# EAGLE design untitled (EAGLE 9.5.0)
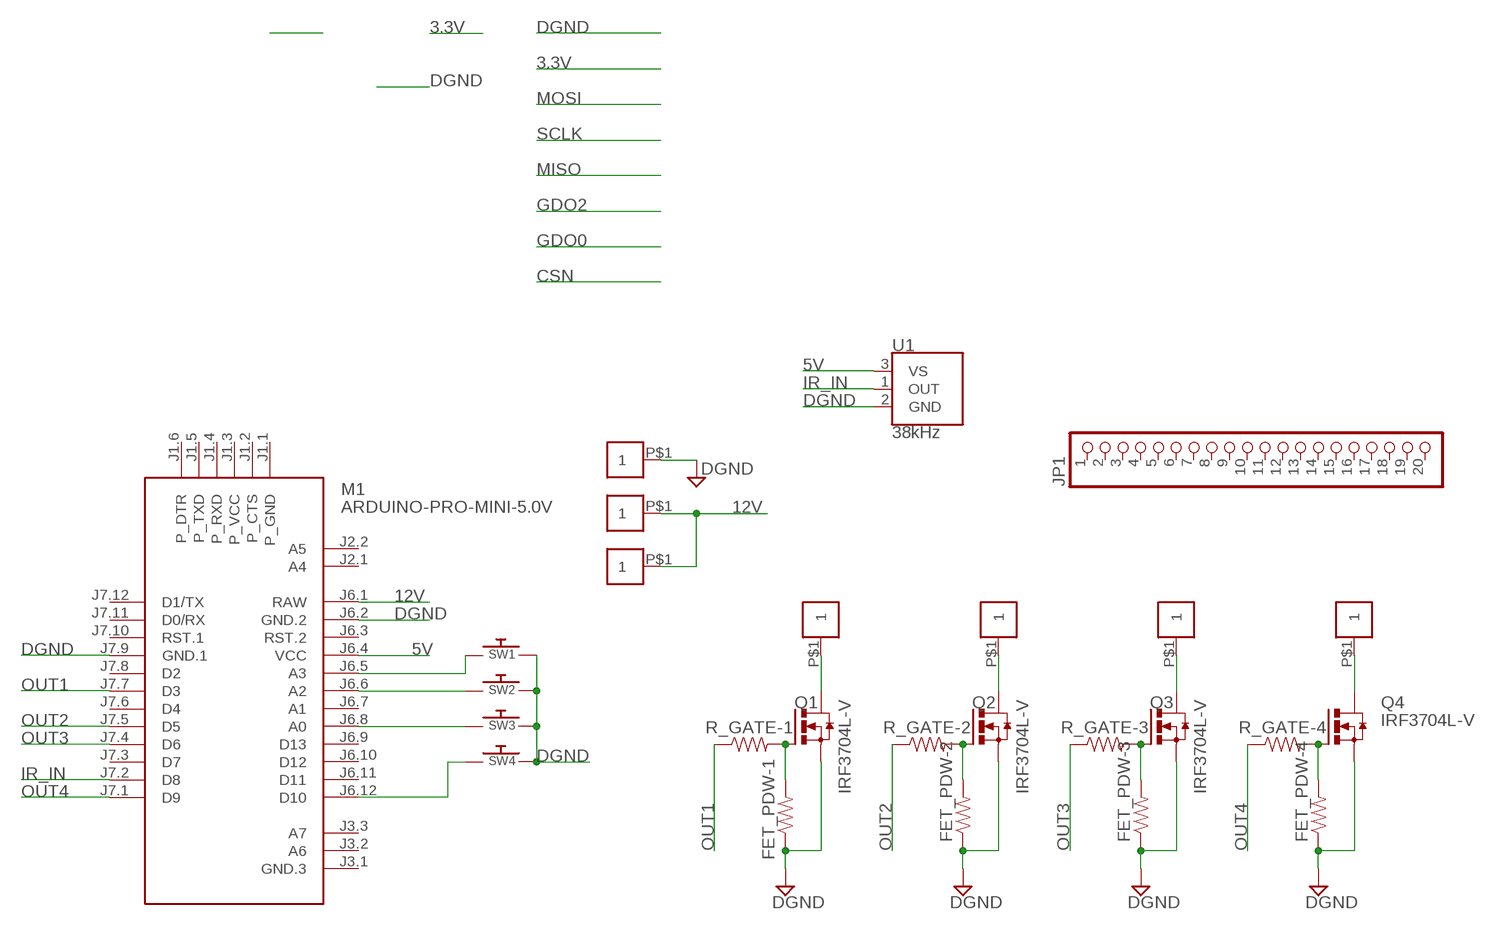
[diagram p0: schematic, sheet 1]

## Parts
FET_PDW-1  RESISTOR0603-RES  [0603-RES]
FET_PDW-2  RESISTOR0603-RES  [0603-RES]
FET_PDW-3  RESISTOR0603-RES  [0603-RES]
FET_PDW-4  RESISTOR0603-RES  [0603-RES]
JP1  PINHD-1X20  [1X20]
M1  ARDUINO-PRO-MINI-5.0V  [ARDUINO-PRO-MINI]
Q1  IRF3704L-V  [TO262-V]
Q2  IRF3704L-V  [TO262-V]
Q3  IRF3704L-V  [TO262-V]
Q4  IRF3704L-V  [TO262-V]
R_GATE-1  RESISTOR0603-RES  [0603-RES]
R_GATE-2  RESISTOR0603-RES  [0603-RES]
R_GATE-3  RESISTOR0603-RES  [0603-RES]
R_GATE-4  RESISTOR0603-RES  [0603-RES]
SW1  SWITCH_PUSHBUTTONC&K_KSS  [BTN_CK_KSS]
SW2  SWITCH_PUSHBUTTONC&K_KSS  [BTN_CK_KSS]
SW3  SWITCH_PUSHBUTTONC&K_KSS  [BTN_CK_KSS]
SW4  SWITCH_PUSHBUTTONC&K_KSS  [BTN_CK_KSS]
U1  38kHz  TSOP38238  [TSOP382]
U$2  1X01_2.54MM  [1X01_2.54MM]
U$3  1X01_2.54MM  [1X01_2.54MM]
U$4  1X01_2.54MM  [1X01_2.54MM]
U$5  1X01_2.54MM  [1X01_2.54MM]
U$6  1X01_2.54MM  [1X01_2.54MM]
U$7  1X01_2.54MM  [1X01_2.54MM]
U$8  1X01_2.54MM  [1X01_2.54MM]

## Nets
5V: M1.J6.4(VCC) U1.3(VS)
12V: M1.J6.1(RAW) U$5.P$1 U$8.P$1
DGND: FET_PDW-1.1 FET_PDW-2.1 FET_PDW-3.1 FET_PDW-4.1 M1.J6.2(GND.2) M1.J7.9(GND.1) Q1.3(S) Q2.3(S) Q3.3(S) Q4.3(S) SW1.P$2 SW2.P$2 SW3.P$2 SW4.P$2 U1.2(GND) U$7.P$1
IR_IN: M1.J7.2(D8) U1.1(OUT)
N$1: FET_PDW-1.2 Q1.1(G) R_GATE-1.2
N$2: FET_PDW-2.2 Q2.1(G) R_GATE-2.2
N$3: FET_PDW-3.2 Q3.1(G) R_GATE-3.2
N$5: Q1.2(D) U$2.P$1
N$6: Q2.2(D) U$3.P$1
N$7: Q3.2(D) U$4.P$1
N$8: FET_PDW-4.2 Q4.1(G) R_GATE-4.2
N$9: Q4.2(D) U$6.P$1
N$10: M1.J6.5(A3) SW1.P$1
N$11: M1.J6.6(A2) SW2.P$1
N$12: M1.J6.8(A0) SW3.P$1
N$13: M1.J6.12(D10) SW4.P$1
OUT1: M1.J7.7(D3) R_GATE-1.1
OUT2: M1.J7.5(D5) R_GATE-2.1
OUT3: M1.J7.4(D6) R_GATE-3.1
OUT4: M1.J7.1(D9) R_GATE-4.1
Unconnected: JP1.1 JP1.2 JP1.3 JP1.4 JP1.5 JP1.6 JP1.7 JP1.8 JP1.9 JP1.10 JP1.11 JP1.12 JP1.13 JP1.14 JP1.15 JP1.16 JP1.17 JP1.18 JP1.19 JP1.20 M1.J1.1(P_GND) M1.J1.2(P_CTS) M1.J1.3(P_VCC) M1.J1.4(P_RXD) M1.J1.5(P_TXD) M1.J1.6(P_DTR) M1.J2.1(A4) M1.J2.2(A5) M1.J3.1(GND.3) M1.J3.2(A6) M1.J3.3(A7) M1.J6.3(RST.2) M1.J6.7(A1) M1.J6.9(D13) M1.J6.10(D12) M1.J6.11(D11) M1.J7.3(D7) M1.J7.6(D4) M1.J7.8(D2) M1.J7.10(RST.1) M1.J7.11(D0/RX) M1.J7.12(D1/TX)

## Library data of the parts
FET_PDW-1-FET_PDW-4 R_GATE-1-R_GATE-4 = 0000_nexxto_resistors:RESISTOR: Resistor Basic schematic elements and footprints for 0603, 1206, and PTH 1/10th watt (small) resistors.
JP1 = adafruit:PINHD-1X20: PIN HEADER
M1 = diy modules:ARDUINO-PRO-MINI-*: Arduino Pro Mini and compatible devices More details available here: https://www.arduino.cc/en/Main/ArduinoBoardProMini Click here to find device on ebay.com <http://www.ebay.com/sch/arduino+pro+mini>
Q1-Q4 = transistor-power:IRF3704: SMPS MOSFET HEXFET® Power MOSFET Source: http://www.irf.com/product-info/datasheets/data/irf3704.pdf
SW1-SW4 = adafruit:SWITCH_PUSHBUTTON: Buttons SOFTTOUCHSMD_SJ - Soft touch temporary push button (Super Junk Akihabara) Compatible with SKPMANE010 [Mouser: 688-SKPMAN] C&K_KSS = Digikey: KSS221GLFS
U1 = sparkFun-Sensors:TSOP382: Vishay Semiconductor TSOP32838 - 38kHz IR Receiver These products are miniaturized IR receiver modules for infrared remote control systems. A PIN diode and a preamplifier are assembled on a leadframe, the epoxy package contains an IR filter. The demodulated output signal can be directly connected to a microprocessor for decoding.; PROD_ID: SEN-10266
U$2-U$8 = 0000_nexxto_connectors:1X01_2.54MM

## Board
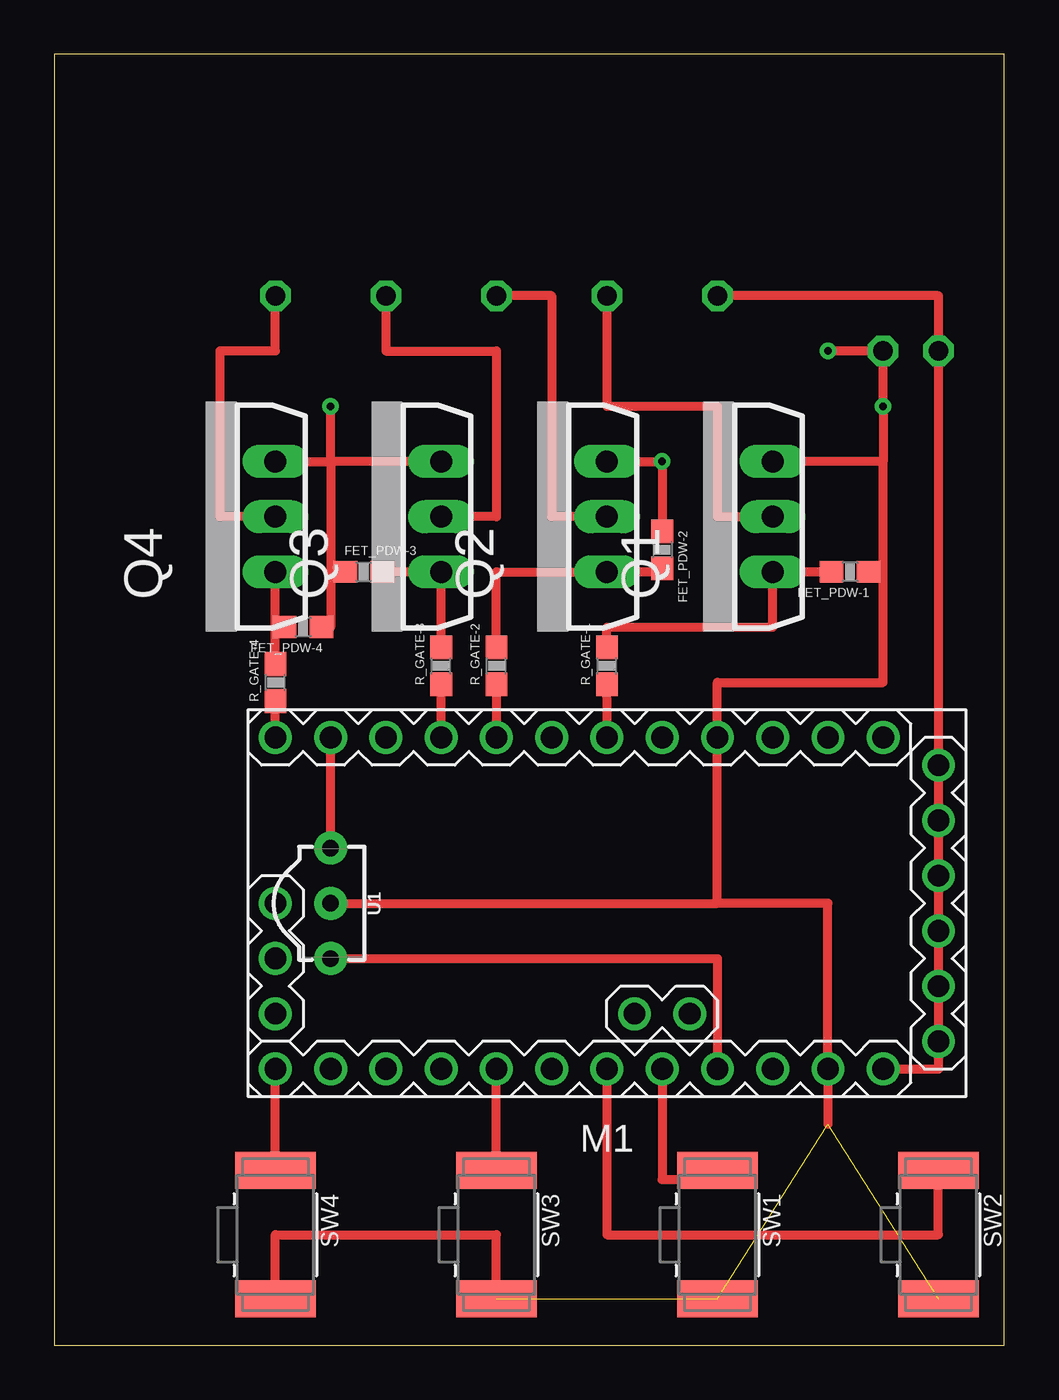
[diagram p1: board, top side]
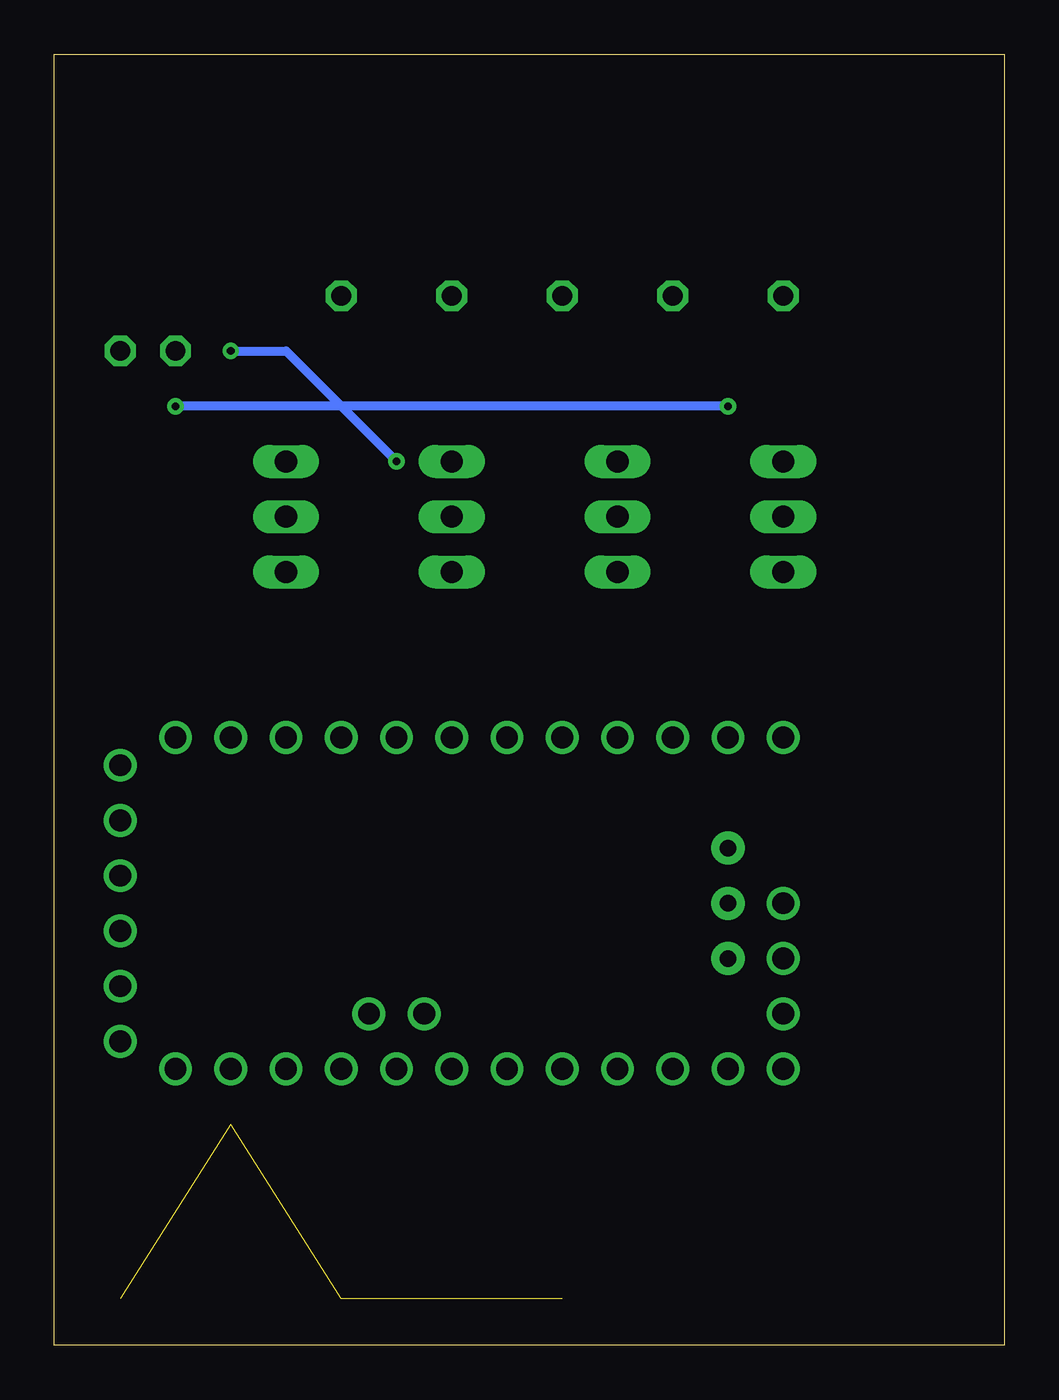
[diagram p2: board, bottom side, seen from below]

Size 43.67 x 59.36 mm. Coordinates in mm from the lower left corner, seen from the top.
Outline: 0,0 43.67,0 43.67,59.36 0,59.36 0,0
Copper layers (1*16): Top 0.035mm / dielectric 1.5mm / Bottom 0.035mm
Design rules "default": minimum track width 6mil, minimum drill 0.35mm, track to track 6mil, track to pad 6mil, pad to pad 6mil, via to via 6mil, smd to smd 6mil, copper to edge 40mil, drill to drill 6mil, minimum pad ring 10mil, minimum via ring 8mil, stop-mask expansion 4mil, vias tented up to drill 0mil, thermal gap 10mil

### Footprints (pad centres in the part's own frame; a part is rotated, then mirrored left to right if it is on the bottom)
0603-RES = smd 1.1 x 1: 1 -0.85,0; 2 0.85,0
1X20 = drill 1.016 long: 1 -24.13,0; 2 -21.59,0; 3 -19.05,0; 4 -16.51,0; 5 -13.97,0; 6 -11.43,0; 7 -8.89,0; 8 -6.35,0; 9 -3.81,0; 10 -1.27,0; 11 1.27,0; 12 3.81,0; 13 6.35,0; 14 8.89,0; 15 11.43,0; 16 13.97,0; 17 16.51,0; 18 19.05,0; 19 21.59,0; 20 24.13,0
ARDUINO-PRO-MINI = drill 1: J1.1 -15.24,6.35; J1.2 -15.24,3.81; J1.3 -15.24,1.27; J1.4 -15.24,-1.27; J1.5 -15.24,-3.81; J1.6 -15.24,-6.35; J2.1 -1.27,5.08; J2.2 -3.81,5.08; J3.1 15.24,0; J3.2 15.24,2.54; J3.3 15.24,5.08; J6.1 -12.7,7.62; J6.2 -10.16,7.62; J6.3 -7.62,7.62; J6.4 -5.08,7.62; J6.5 -2.54,7.62; J6.6 0,7.62; J6.7 2.54,7.62; J6.8 5.08,7.62; J6.9 7.62,7.62; J6.10 10.16,7.62; J6.11 12.7,7.62; J6.12 15.24,7.62; J7.1 15.24,-7.62; J7.2 12.7,-7.62; J7.3 10.16,-7.62; J7.4 7.62,-7.62; J7.5 5.08,-7.62; J7.6 2.54,-7.62; J7.7 0,-7.62; J7.8 -2.54,-7.62; J7.9 -5.08,-7.62; J7.10 -7.62,-7.62; J7.11 -10.16,-7.62; J7.12 -12.7,-7.62
TO262-V = drill 1.016 long: 1 -2.54,0; 2 0,0; 3 2.54,0
BTN_CK_KSS = smd 1.7 x 3.7: P$1 -2.95,0; P$2 2.95,0
TSOP382 = drill 0.762 pad 1.524: 1 -2.54,0; 2 0,0; 3 2.54,0
1X01_2.54MM = drill 0.9 octagon: P$1 0,0

### Placement (x,y rotation side)
FET_PDW-1  36.58,35.56 180 top
FET_PDW-2  27.94,36.58 270 top
FET_PDW-3  14.22,35.56 0 top
FET_PDW-4  11.43,33.02 180 top
JP1  50.8,29.21 90 top  (outside the outline)
M1  25.4,20.32 180 top
Q1  33.02,38.1 90 top
Q2  25.4,38.1 90 top
Q3  17.78,38.1 90 top
Q4  10.16,38.1 90 top
R_GATE-1  25.4,31.24 90 top
R_GATE-2  20.32,31.24 90 top
R_GATE-3  17.78,31.24 90 top
R_GATE-4  10.16,30.48 90 top
SW1  30.48,5.08 270 top
SW2  40.64,5.08 270 top
SW3  20.32,5.08 270 top
SW4  10.16,5.08 270 top
U1  12.7,20.32 270 top
U$2  25.4,48.26 0 top
U$3  20.32,48.26 0 top
U$4  15.24,48.26 0 top
U$5  30.48,48.26 0 top
U$6  10.16,48.26 0 top
U$7  38.1,45.72 0 top
U$8  40.64,45.72 0 top

### Tracks (layer width: path | path; a pad name or v marks a point on that pad's centre or on a via)
5V
  Top 0.406: U1.3 30.48,17.78 M1.J6.4
12V
  Top 0.406: U$5.P$1 40.64,48.26 U$8.P$1 40.64,12.7 M1.J6.1
DGND  (via drill 0.35)  (3 unrouted)
  Top 0.406: Q4.3 12.7,40.64 | FET_PDW-3.1 12.7,35.56 | 12.7,40.64 12.7,35.56 | Q2.3 v27.94,40.64 FET_PDW-2.1 | 30.48,20.32 35.56,20.32 M1.J6.2 35.56,10.16 | 30.48,20.32 M1.J7.9 30.48,30.48 38.1,30.48 38.1,35.56 | 38.1,40.64 v38.1,43.18 U$7.P$1 v35.56,45.72 | 38.1,40.64 Q1.3 | 12.7,35.56 12.7,33.02 FET_PDW-4.1 | Q3.3 12.7,40.64 | 12.7,40.64 v12.7,43.18 | FET_PDW-1.1 38.1,35.56 | 38.1,35.56 38.1,40.64 | U1.2 30.48,20.32 | SW4.P$2 10.16,5.08 20.32,5.08 SW3.P$2
  Bottom 0.406: v35.56,45.72 33.02,45.72 v27.94,40.64 | v12.7,43.18 v38.1,43.18
IR_IN
  Top 0.406: U1.1 M1.J7.2
N$1
  Top 0.406: FET_PDW-1.2 Q1.1 33.02,33.02 25.4,33.02 R_GATE-1.2
N$2
  Top 0.406: FET_PDW-2.2 27.94,35.56 Q2.1 20.32,35.56 R_GATE-2.2
N$3
  Top 0.406: 17.78,32.42 R_GATE-3.2 Q3.1 FET_PDW-3.2
N$5
  Top 0.406: U$2.P$1 25.4,43.18 30.48,43.18 30.48,38.1 Q1.2
N$6
  Top 0.406: U$3.P$1 22.86,48.26 22.86,38.1 Q2.2
N$7
  Top 0.406: U$4.P$1 15.24,45.72 20.32,45.72 20.32,38.1 Q3.2
N$8
  Top 0.406: R_GATE-4.2 10.16,33.02 | 10.16,33.02 Q4.1 | FET_PDW-4.2 10.16,33.02
N$9
  Top 0.406: Q4.2 7.62,38.1 7.62,45.72 10.16,45.72 U$6.P$1
N$10
  Top 0.406: M1.J6.5 27.94,7.62 30.48,7.62 SW1.P$1
N$11
  Top 0.406: SW2.P$1 40.44,7.83 | 40.44,7.83 40.23,7.62 | M1.J6.6 25.4,5.08 40.64,5.08 40.64,7.62 40.44,7.83
N$12
  Top 0.406: SW3.P$1 M1.J6.8
N$13
  Top 0.406: SW4.P$1 M1.J6.12
OUT1
  Top 0.406: M1.J7.7 25.44,27.98 R_GATE-1.1
OUT2
  Top 0.406: R_GATE-2.1 M1.J7.5
OUT3
  Top 0.406: M1.J7.4 R_GATE-3.1
OUT4
  Top 0.406: M1.J7.1 R_GATE-4.1